# EAGLE design esp_vectorgame_v1.0 (EAGLE 9.6.2)
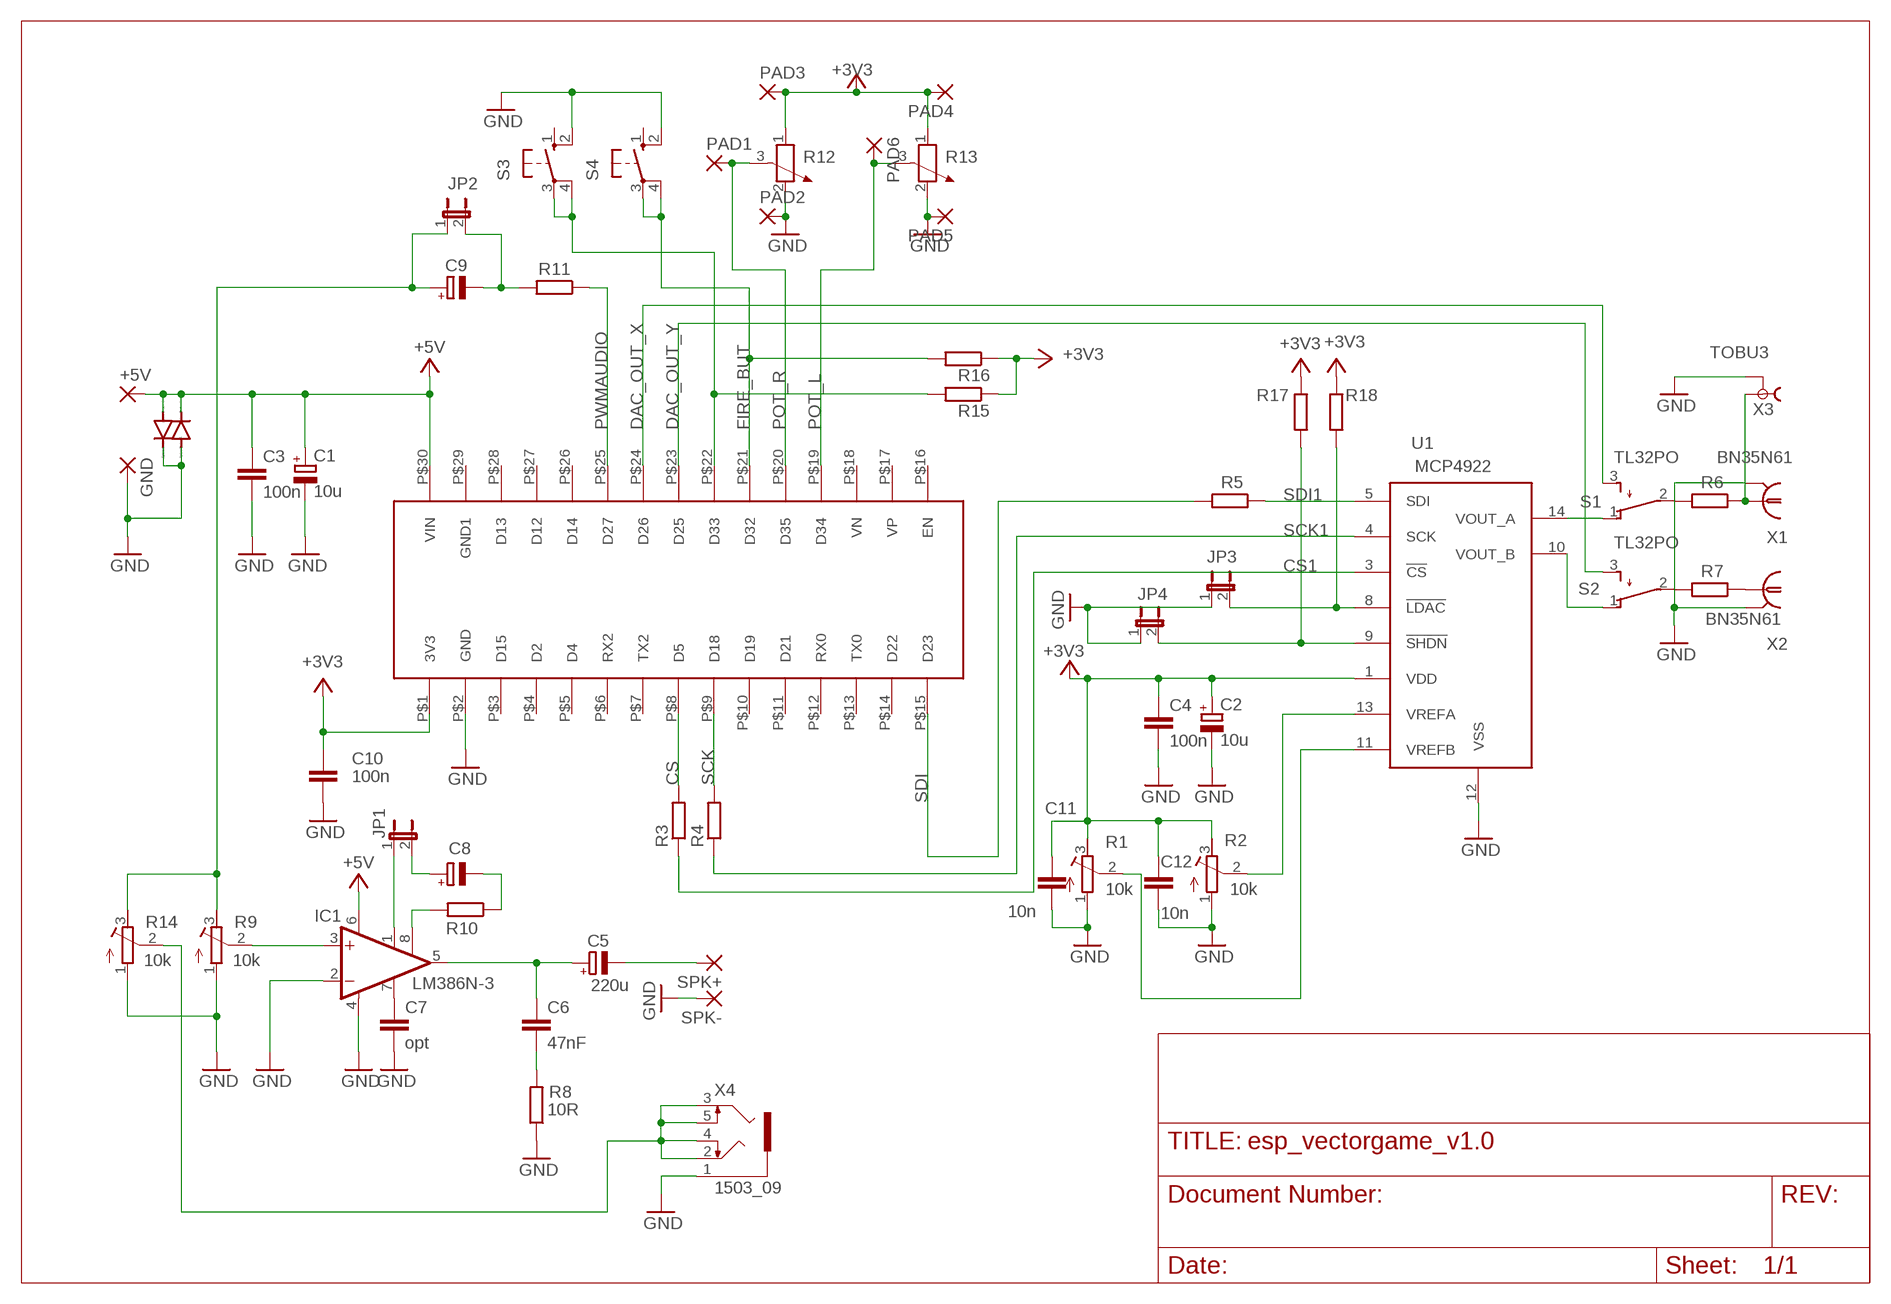
[diagram p0: schematic, sheet 1]

## Parts
+5V  3,81/1,4  [3,81/1,4]
C1  10u  CPOL-EUE2,5-6E  [E2,5-6E]
C2  10u  CPOL-EUE2,5-6E  [E2,5-6E]
C3  100n  C-EUC0805  [C0805]
C4  100n  C-EUC0805  [C0805]
C5  220u  CPOL-EUE2,5-6E  [E2,5-6E]
C6  47nF  C-EUC0805  [C0805]
C7  opt  C-EUC0805  [C0805]
C8  CPOL-EUE2,5-6E  [E2,5-6E]
C9  CPOL-EUE2,5-6E  [E2,5-6E]
C10  100n  C-EUC0805  [C0805]
C11  10n  C-EUC0805  [C0805]
C12  10n  C-EUC0805  [C0805]
GND  3,81/1,4  [3,81/1,4]
IC1  LM386N-3  [DIL08]
JP1  JP1E  [JP1]
JP2  JP1E  [JP1]
JP3  JP1E  [JP1]
JP4  JP1E  [JP1]
PAD1  3,81/1,4  [3,81/1,4]
PAD2  3,81/1,4  [3,81/1,4]
PAD3  3,81/1,4  [3,81/1,4]
PAD4  3,81/1,4  [3,81/1,4]
PAD5  3,81/1,4  [3,81/1,4]
PAD6  3,81/1,4  [3,81/1,4]
R1  10k  R-TRIMM64W  [RTRIM64W]
R2  10k  R-TRIMM64W  [RTRIM64W]
R3  R-EU_R0805  [R0805]
R4  R-EU_R0805  [R0805]
R5  R-EU_R0805  [R0805]
R6  R-EU_R0805  [R0805]
R7  R-EU_R0805  [R0805]
R8  10R  R-EU_R0805  [R0805]
R9  10k  R-TRIMM64W  [RTRIM64W]
R10  R-EU_R0805  [R0805]
R11  R-EU_R0805  [R0805]
R12  POTENTIOMETER_PT-10  [PT-10]
R13  POTENTIOMETER_PT-10  [PT-10]
R14  10k  R-TRIMM64W  [RTRIM64W]
R15  R-EU_R0805  [R0805]
R16  R-EU_R0805  [R0805]
R17  R-EU_R0805  [R0805]
R18  R-EU_R0805  [R0805]
S1  TL32PO  [TL3XPO]
S2  TL32PO  [TL3XPO]
S3  10-XX  [B3F-10XX]
S4  10-XX  [B3F-10XX]
SPK+  3,81/1,4  [3,81/1,4]
SPK-  3,81/1,4  [3,81/1,4]
TVS1  1N4148DO35-7  [DO35-7]
TVS2  1N4148DO35-7  [DO35-7]
U1  MCP4922  [SO-14]
U$2  ESP_WROOM32  [ESP_NODEMCU]
X1  BN35N61  [B35N61]
X2  BN35N61  [B35N61]
X3  TOBU3  [TOBU3]
X4  1503_09  [1503_09]

## Nets
+3V3: C2.+ C4.1 C10.1 C11.1 C12.1 PAD3.1(P) PAD4.1(P) R1.3(E) R2.3(E) R12.1 R13.1 R15.1 R16.1 R17.1 R18.1 U1.1(VDD) U$2.P$1(3V3)
+5V: +5V.1(P) C1.+ C3.1 IC1.6(VS) TVS1.C TVS2.A U$2.P$30(VIN)
CS: R3.2 U$2.P$8(D5)
CS1: R3.1 U1.3(!CS)
DAC_OUT_X: S1.3(S) U$2.P$24(D26)
DAC_OUT_Y: S2.3(S) U$2.P$23(D25)
FIRE_BUT: R16.2 S4.3(P) S4.4(P1) U$2.P$21(D32)
GND: C1.- C2.- C3.2 C4.2 C7.2 C10.2 C11.2 C12.2 GND.1(P) IC1.2(-IN) IC1.4(GND) JP3.1 JP4.1 PAD2.1(P) PAD5.1(P) R1.1(A) R2.1(A) R8.1 R9.1(A) R12.2 R13.2 R14.1(A) S3.2(S1) S4.2(S1) SPK-.1(P) TVS1.A TVS2.C U1.12(VSS) U$2.P$2(GND) X1.2 X1.3 X1.4 X1.5 X2.2 X2.3 X2.4 X2.5 X3.2 X3.2@1 X3.2@2 X4.1
N$1: JP3.2 R18.2 U1.8(!LDAC)
N$2: R7.1 X2.1
N$3: R7.2 S2.2(P)
N$4: S1.1(O) U1.14(VOUT_A)
N$6: R1.2(S) U1.11(VREFB)
N$7: R2.2(S) U1.13(VREFA)
N$8: S2.1(O) U1.10(VOUT_B)
N$9: R6.1 X1.1 X3.1
N$10: R6.2 S1.2(P)
N$11: C6.2 R8.2
N$12: IC1.1(GAIN) JP1.1
N$13: C5.+ C6.1 IC1.5(OUT)
N$14: C7.1 IC1.7(BYPASS)
N$15: IC1.3(+IN) R9.2(S)
N$16: C8.+ JP1.2
N$17: IC1.8(GAIN) R10.2
N$18: C8.- R10.1
N$19: C9.- JP2.2 R11.2
N$21: C9.+ JP2.1 R9.3(E) R14.3(E)
N$22: R14.2(S) X4.2 X4.3 X4.4 X4.5
N$23: C5.- SPK+.1(P)
N$24: R15.2 S3.3(P) S3.4(P1) U$2.P$22(D33)
N$25: JP4.2 R17.2 U1.9(!SHDN)
POT_L: PAD6.1(P) R13.3 U$2.P$19(D34)
POT_R: PAD1.1(P) R12.3 U$2.P$20(D35)
PWMAUDIO: R11.1 U$2.P$25(D27)
SCK: R4.2 U$2.P$9(D18)
SCK1: R4.1 U1.4(SCK)
SDI: R5.2 U$2.P$15(D23)
SDI1: R5.1 U1.5(SDI)
Unconnected: S3.1(S) S4.1(S) U$2.P$3(D15) U$2.P$4(D2) U$2.P$5(D4) U$2.P$6(RX2) U$2.P$7(TX2) U$2.P$10(D19) U$2.P$11(D21) U$2.P$12(RX0) U$2.P$13(TX0) U$2.P$14(D22) U$2.P$16(EN) U$2.P$17(VP) U$2.P$18(VN) U$2.P$26(D14) U$2.P$27(D12) U$2.P$28(D13) U$2.P$29(GND1)

## Library data of the parts
+5V GND PAD1-PAD6 SPK+ SPK- = wirepad:3,81/1,4: THROUGH-HOLE PAD
C1 C2 C5 C8 C9 = rcl:CPOL-EU: POLARIZED CAPACITOR, European symbol; SPICEPREFIX: C
C3 C4 C6 C7 C10-C12 = rcl:C-EU: CAPACITOR, European symbol; SPICEPREFIX: C
IC1 = linear_ingmar:LM386?-*: Low Voltage Audio Power Amplifier Source: http://cache.national.com/ds/LM/LM386.pdf
JP1-JP4 = jumper:JP1E: JUMPER
R1 R2 R9 R14 = rcl:R-TRIMM: Trimm resistor; SPICEMODEL: X; SPICEPREFIXL: POT
R3-R8 R10 R11 R15-R18 = rcl:R-EU_: RESISTOR, European symbol; SPICEPREFIX: R
R12 R13 = rcl:POTENTIOMETER_: Potentiometer; SPICEMODEL: POT; SPICEPREFIX: X
S1 S2 = switchneu:TL32PO: TINY SWITCH ON - MOM Source: http://www2.produktinfo.conrad.com/datenblaetter/700000-724999/705152-da-01-de-Subminiaturschalter_TL_36YO.pdf
S3 S4 = switch-omron:10-XX: OMRON SWITCH; MPN: B3F-1000; OC_FARNELL: 176432; OC_NEWARK: 36M3542
TVS1 TVS2 = diode:1N4148: DIODE high speed (Philips)
U1 = MCP4922:MCP4922: MCP4922 - 12bit DAC, SPI interface Datasheet: http://ww1.microchip.com/downloads/en/DeviceDoc/22250A.pdf
U$2 = meine:ESP_WROOM32
X1 X2 = con-coax:BN35N61: BNC CONNECTOR M/A COM www.macom.com distributor Farnell 149-452; OC_FARNELL: unknown; OC_NEWARK: unknown
X3 = con-hirschmann:TOBU3: Female Cinch CONNECTOR ( RCA Jack ); MF: FARNELL; MPN: TOBU 3; OC_FARNELL: 592791; OC_NEWARK: 06WX5914
X4 = con-lumberg:1503_09: Jack connectors according to JISC 6560, 3.5 mm Klinkeneinbaukupplung nach JISC 6560, 3,5 mm, 3-polig/ stereo, abgewinkelte Ausführung, mit 2 Öffnern und Lötaugen, für Leiterplatten Rückseitenmontage Source: http://www.lumberg.com/Produkte/PDFs/1503_09.pdf; OC_FARNELL: 1243244; OC_NEWARK: unknown

## Board
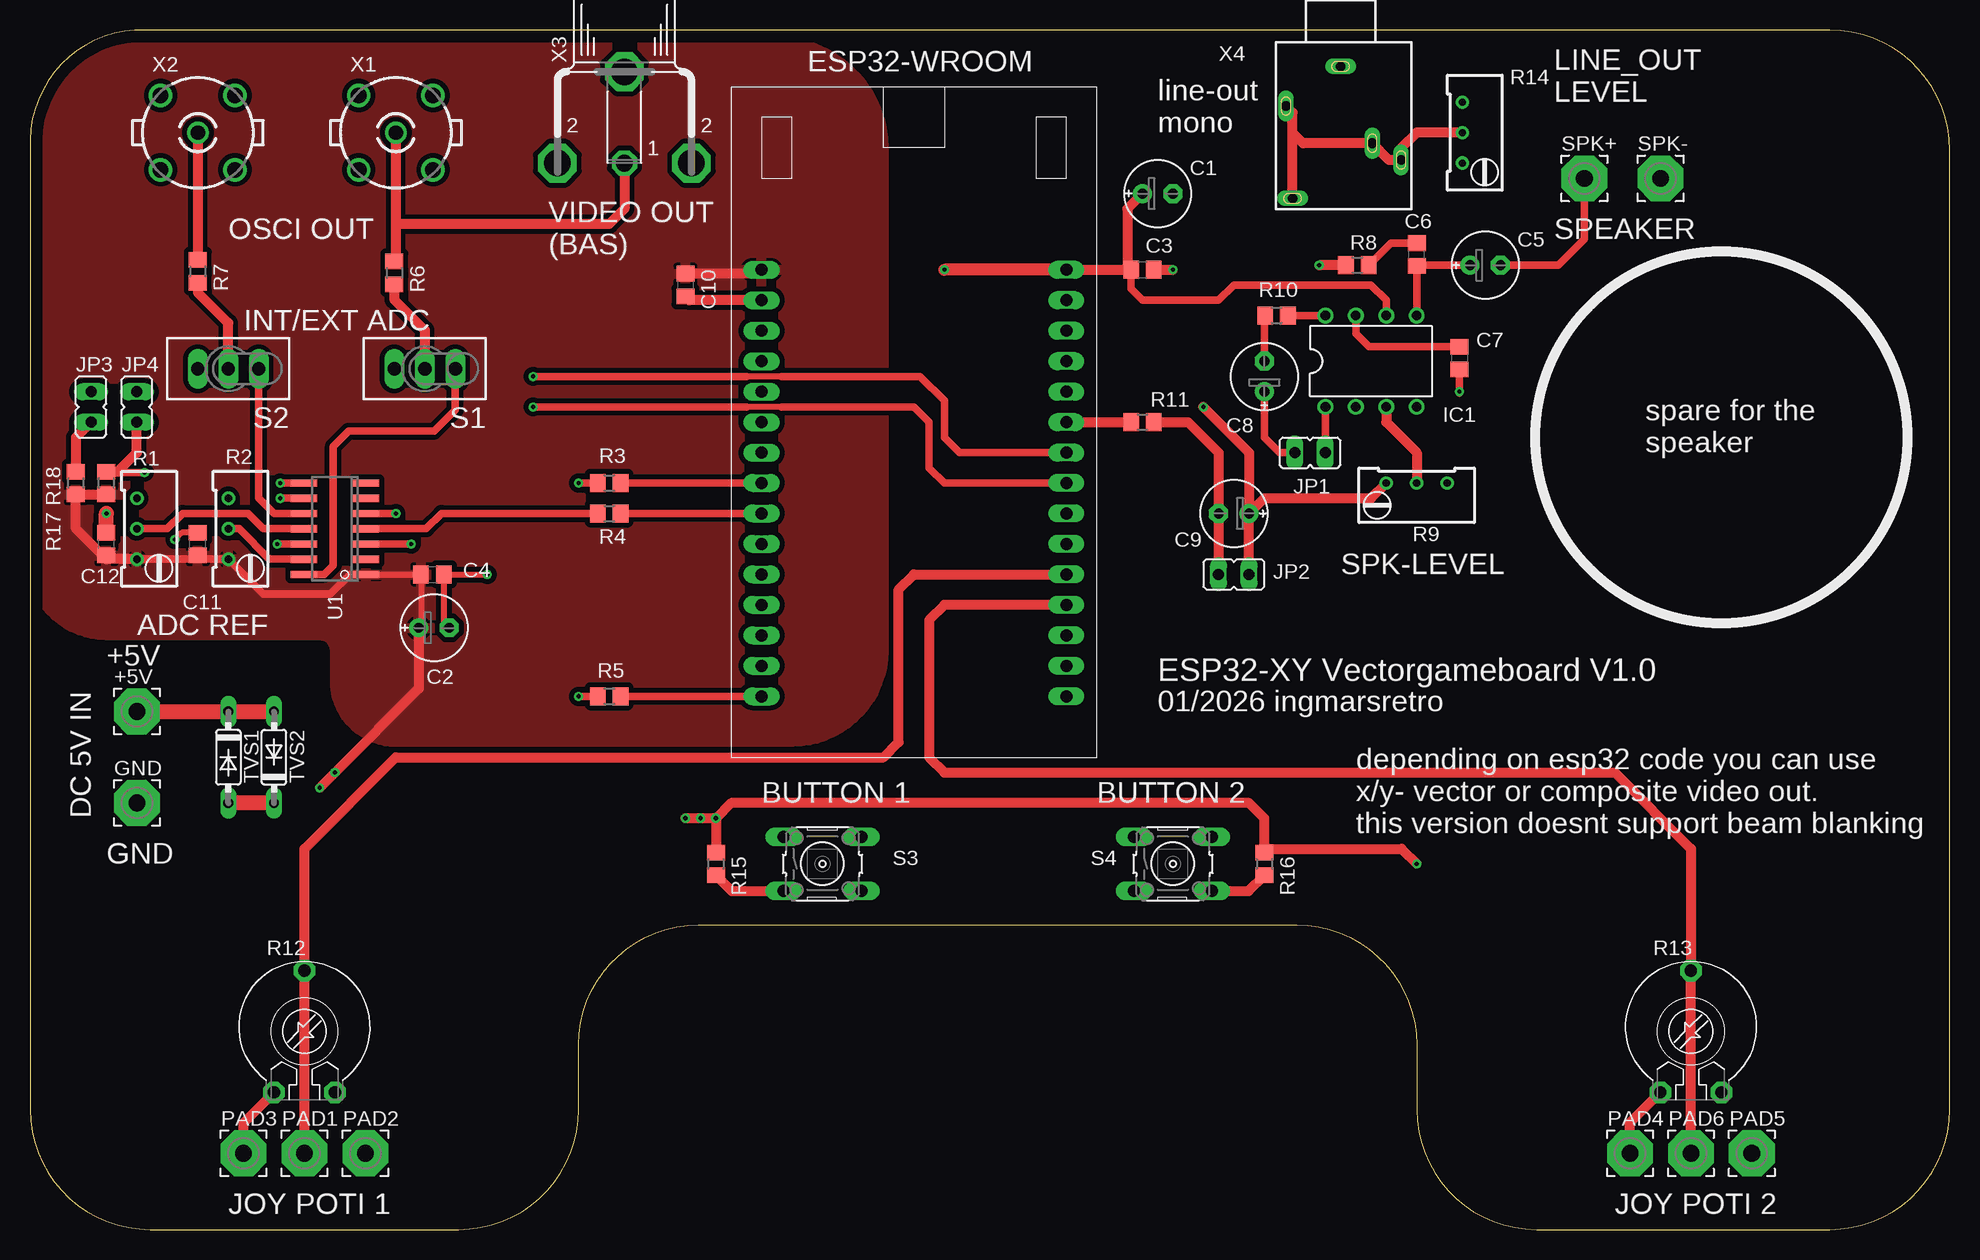
[diagram p1: board, top side]
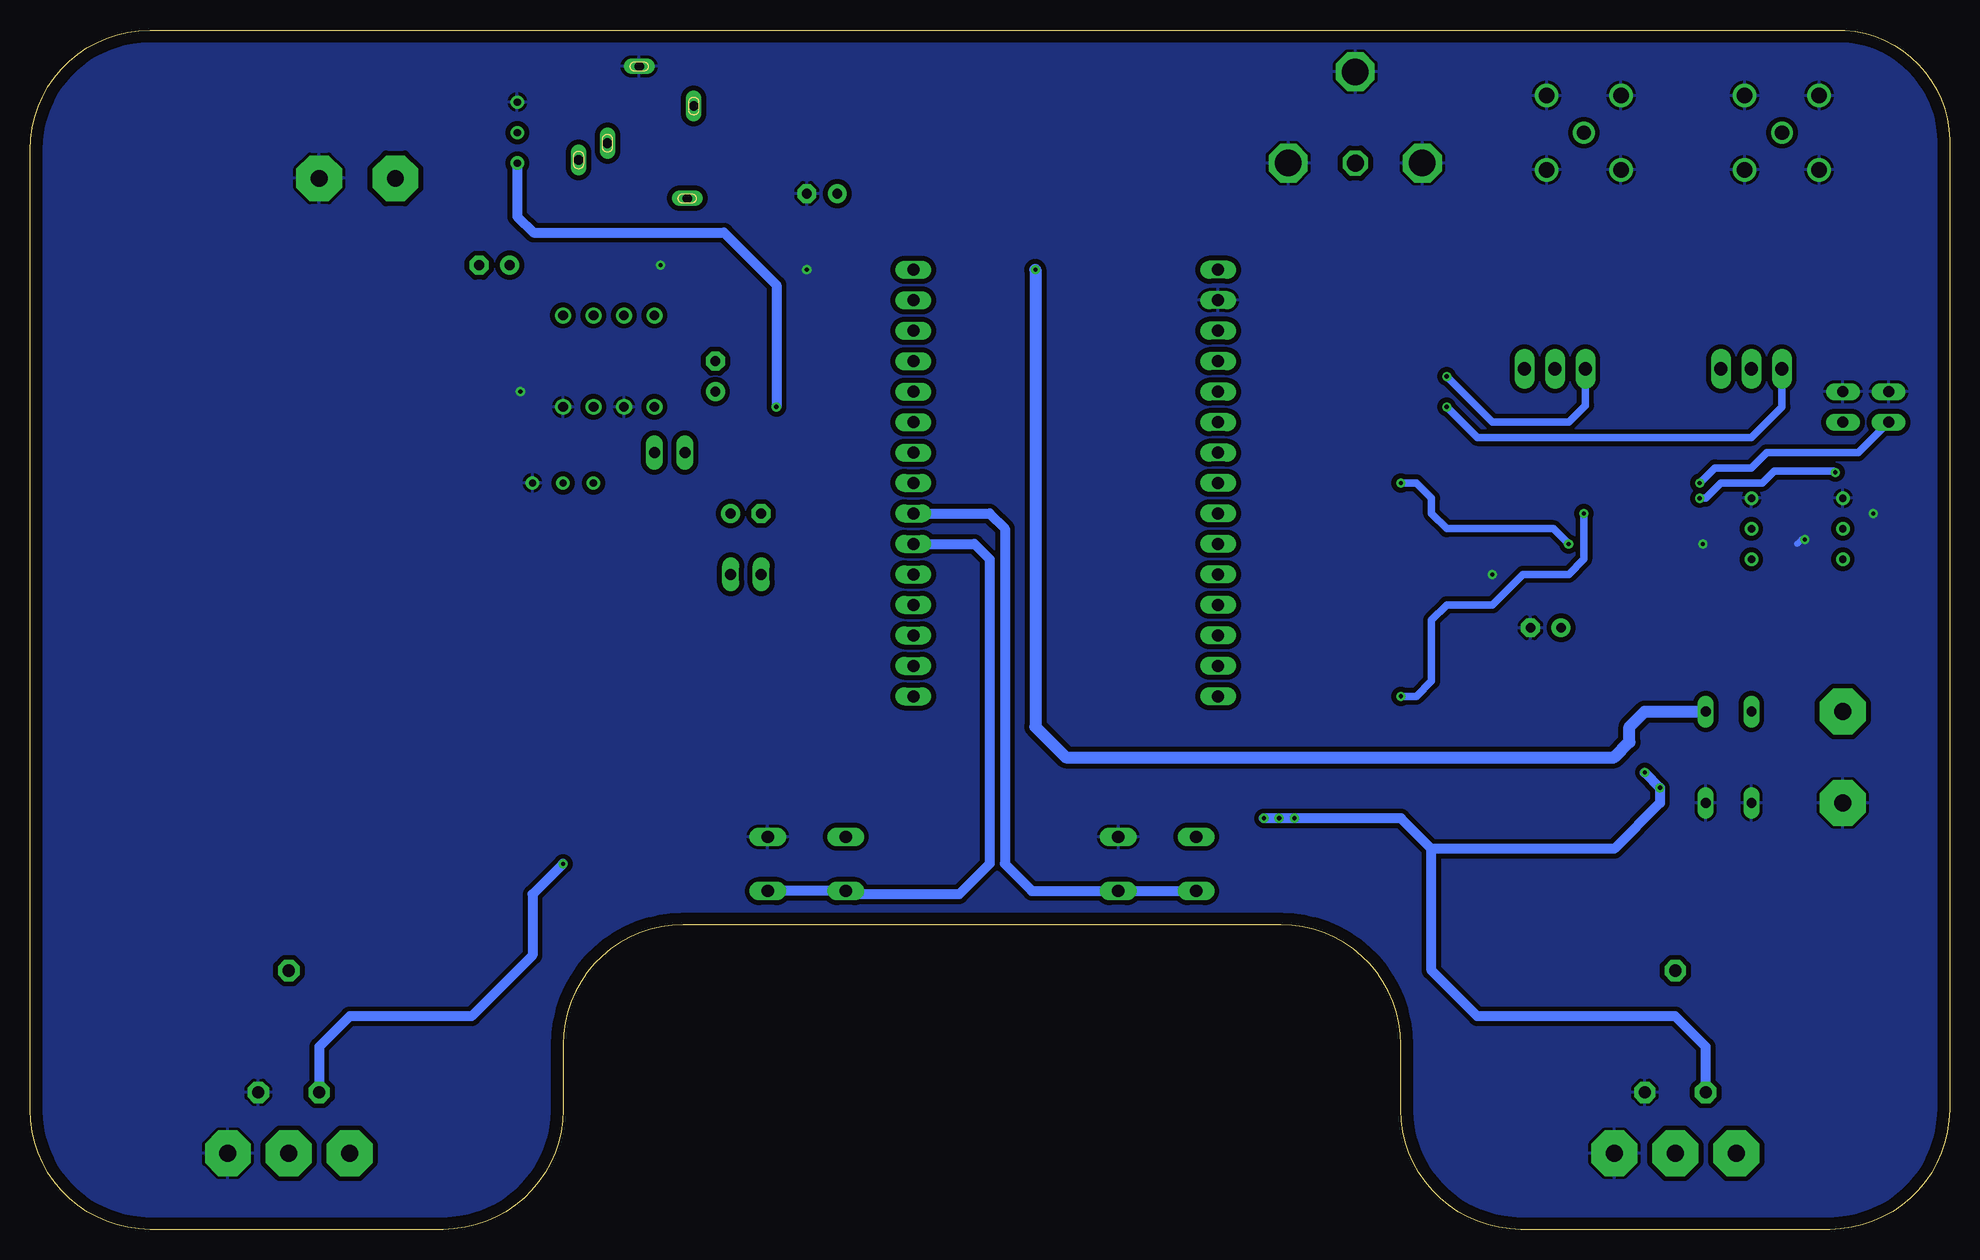
[diagram p2: board, bottom side, seen from below]

Size 160.02 x 100 mm. Coordinates in mm from the lower left corner, seen from the top.
Outline: 150.02,100 8.75,100 arc90 0.02,90 0.02,10 arc90 10.02,0 35.74,0 arc90 45.74,10 45.74,15.4 arc-90 55.74,25.4 105.59,25.4 arc-90 115.59,15.4 115.59,10 arc90 125.59,0 150.02,0 arc90 160.02,10 160.02,90 arc90 150.02,100
Copper layers (1*16): Top 0.035mm / dielectric 1.5mm / Bottom 0.035mm
Design rules "default": minimum track width 6mil, minimum drill 0.35mm, track to track 6mil, track to pad 6mil, pad to pad 6mil, via to via 6mil, smd to smd 6mil, copper to edge 40mil, drill to drill 6mil, minimum pad ring 10mil, minimum via ring 8mil, stop-mask expansion 4mil, vias tented up to drill 0mil, thermal gap 10mil

### Footprints (pad centres in the part's own frame; a part is rotated, then mirrored left to right if it is on the bottom)
3,81/1,4 = drill 1.397 pad 3.81 octagon: 1 0,0
E2,5-6E = drill 0.813 pad 1.575: + -1.27,0 | drill 0.813 pad 1.575 octagon: - 1.27,0
C0805 = smd 1.3 x 1.5: 1 -0.95,0; 2 0.95,0
DIL08 = drill 0.813 pad 1.27: 1 -3.81,-3.81; 2 -1.27,-3.81; 3 1.27,-3.81; 4 3.81,-3.81; 5 3.81,3.81; 6 1.27,3.81; 7 -1.27,3.81; 8 -3.81,3.81
JP1 = drill 0.914 long: 1 0,-1.27; 2 0,1.27
RTRIM64W = drill 0.61: 1 1.27,-2.54; 2 1.27,0; 3 1.27,2.54
R0805 = smd 1.3 x 1.5: 1 -0.95,0; 2 0.95,0
PT-10 = drill 1.016 pad 1.778 octagon: 1 -2.54,-5.08; 2 2.54,-5.08; 3 0,5.08
TL3XPO = drill 1.1 pad 1.422 long: 1 -2.54,0; 2 0,0; 3 2.54,0
B3F-10XX = drill 1.016 long: 1 -3.251,2.261; 2 3.251,2.261; 3 -3.251,-2.261; 4 3.251,-2.261
DO35-7 = drill 0.813 long: A 3.81,0; C -3.81,0
SO-14 = smd 0.6 x 2.2: 1 -3.81,-2.6; 2 -2.54,-2.6; 3 -1.27,-2.6; 4 0,-2.6; 5 1.27,-2.6; 6 2.54,-2.6; 7 3.81,-2.6; 8 3.81,2.6; 9 2.54,2.6; 10 1.27,2.6; 11 0,2.6; 12 -1.27,2.6; 13 -2.54,2.6; 14 -3.81,2.6
ESP_NODEMCU = drill 1 long: P$1 0,-12.7; P$2 2.54,-12.7; P$3 5.08,-12.7; P$4 7.62,-12.7; P$5 10.16,-12.7; P$6 12.7,-12.7; P$7 15.24,-12.7; P$8 17.78,-12.7; P$9 20.32,-12.7; P$10 22.86,-12.7; P$11 25.4,-12.7; P$12 27.94,-12.7; P$13 30.48,-12.7; P$14 33.02,-12.7; P$15 35.56,-12.7; P$16 35.56,12.7; P$17 33.02,12.7; P$18 30.48,12.7; P$19 27.94,12.7; P$20 25.4,12.7; P$21 22.86,12.7; P$22 20.32,12.7; P$23 17.78,12.7; P$24 15.24,12.7; P$25 12.7,12.7; P$26 10.16,12.7; P$27 7.62,12.7; P$28 5.08,12.7; P$29 2.54,12.7; P$30 0,12.7
B35N61 = drill 1.2: 1 0,0 | drill 1.3: 2 3.099,3.099; 3 -3.099,3.099; 4 -3.099,-3.099; 5 3.099,-3.099
TOBU3 = drill 1.397 octagon: 1 0,-2.54 | drill 2.21 octagon: 2 5.588,-2.54; 2@1 -5.588,-2.54; 2@2 0,5.08
1503_09 = drill 0.8 pad 1.2 long: 1 0,-2.1; 2 -4.55,-5.4; 3 5.05,-9.9; 4 -4,-13.1; 5 2.65,-8.5

### Placement (x,y rotation side)
+5V  8.91,43.18 0 top
C1  94,86.36 0 top
C2  33.67,50.16 0 top
C3  92.73,80.01 0 top
C4  33.55,54.61 0 top
C5  121.3,80.39 0 top
C6  115.59,81.28 90 top
C7  119.14,72.64 270 top
C8  102.89,71.12 90 top
C9  100.35,59.69 180 top
C10  54.63,78.74 270 top
C11  13.99,57.15 90 top
C12  6.37,57.15 90 top
GND  8.91,35.56 0 top
IC1  111.78,72.39 0 top
JP1  106.7,64.77 90 top
JP2  100.35,54.61 90 top
JP3  5.1,68.58 180 top
JP4  8.91,68.58 180 top
PAD1  22.88,6.35 0 top
PAD2  27.96,6.35 0 top
PAD3  17.8,6.35 0 top
PAD4  133.37,6.35 0 top
PAD5  143.53,6.35 0 top
PAD6  138.45,6.35 0 top
R1  10.18,58.42 180 top
R2  17.8,58.42 180 top
R3  48.28,62.23 0 top
R4  48.28,59.69 0 top
R5  48.28,44.45 0 top
R6  30.37,79.76 270 top
R7  13.99,79.88 270 top
R8  110.64,80.39 0 top
R9  115.59,60.96 90 top
R10  103.9,76.2 0 top
R11  92.73,67.31 0 top
R12  22.88,16.51 0 top
R13  138.45,16.51 0 top
R14  120.67,91.44 180 top
R15  57.17,30.48 270 top
R16  102.89,30.48 270 top
R17  6.37,62.23 90 top
R18  3.83,62.23 90 top
S1  32.91,71.75 180 top
S2  16.53,71.75 180 top
S3  66.06,30.48 0 top
S4  95.27,30.48 0 top
SPK+  129.56,87.63 0 top
SPK-  135.91,87.63 0 top
TVS1  16.53,39.37 270 top
TVS2  20.34,39.37 90 top
U1  25.42,58.42 90 top
U$2  73.68,80.01 270 top
X1  30.5,91.44 0 top
X2  13.99,91.44 0 top
X3  49.55,91.44 0 top
X4  109.24,99.06 0 top

### Tracks (layer width: path | path; a pad name or v marks a point on that pad's centre or on a via)
+3V3  (via drill 0.35)
  Top 0.508: U1.1 C4.1 32.6,50.16 C2.+ | C11.1 13.99,55.88 | C12.1 6.37,55.88
  Top 0.61: R1.3 13.99,55.88 R2.3 19.45,52.96 25.04,52.96 26.69,54.61 U1.1
  Top 0.813: R1.3 6.37,55.88 3.83,58.42 R18.1 R17.1 | v57.17,34.29 58.44,35.56 101.62,35.56 102.89,34.29 R16.1 103.21,31.75 114.32,31.75 v115.59,30.48 | v57.17,34.29 R15.1 | U$2.P$1 60.66,79.69 C10.1 | PAD4.1 133.37,8.89 R13.1 | PAD3.1 17.8,8.89 R12.1 | C2.+ 32.4,45.09 v25.42,38.1 v24.15,36.83 | v57.17,34.29 v54.63,34.29
  Bottom 0.813: R12.1 20.34,15.24 22.88,17.78 39.39,17.78 43.2,21.59 43.2,31.75 | R13.1 135.91,15.24 133.37,17.78 123.21,17.78 118.13,22.86 118.13,27.94 v115.59,30.48 | v55.9,34.29 45.74,34.29 43.2,31.75 | v55.9,34.29 v57.17,34.29 | v25.42,38.1 v24.15,36.83 24.15,35.56 27.96,31.75 43.2,31.75 | v54.63,34.29 v55.9,34.29
  pour Top (isolate 0.406): 8.91,99.06 62.25,99.06 arc-90 71.14,90.17 71.14,48.26 arc-90 63.52,40.64 30.5,40.64 arc-90 25.42,45.72 25.42,48.26 arc90 24.15,49.53 6.37,49.53 arc-90 0.02,55.88 0.02,91.44 arc-90 7.64,99.06
+5V  (via drill 0.35)
  Top 0.61: C3.1 91.78,78.42 92.73,77.47 99.08,77.47 100.35,78.74 111.78,78.74 113.05,77.47 IC1.6
  Top 0.813: C1.+ 91.46,85.09 91.46,80.33 C3.1 U$2.P$30
  Top 1.016: U$2.P$30 v76.22,80.01
  Top 1.27: +5V.1 TVS1.C TVS2.A
  Bottom 1.016: v76.22,80.01 76.22,41.91 73.68,39.37 27.96,39.37 26.69,40.64 26.69,41.91 25.42,43.18 TVS2.A
CS
  Top 0.61: U$2.P$8 R3.2
CS1  (via drill 0.35)
  Top 0.61: U1.3 v31.77,57.15 | v45.74,62.23 R3.1
  Bottom 0.61: v31.77,57.15 33.04,58.42 41.93,58.42 43.2,59.69 43.2,60.96 44.47,62.23 v45.74,62.23
DAC_OUT_X  (via drill 0.35)
  Top 0.508: 62.63,71.12 59.71,71.12
  Top 0.61: U$2.P$24 77.49,64.77 76.22,66.04 76.22,69.09 74.19,71.12 62.63,71.12 | 59.71,71.12 v41.93,71.12
  Bottom 0.61: v41.93,71.12 38.12,67.31 31.77,67.31 30.37,68.71 S1.3
DAC_OUT_Y  (via drill 0.35)
  Top 0.508: 62.63,68.58 59.71,68.58
  Top 0.61: U$2.P$23 76.22,62.23 74.95,63.5 74.95,67.31 73.68,68.58 62.63,68.58 | 59.71,68.58 v41.93,68.58
  Bottom 0.61: v41.93,68.58 39.39,66.04 16.53,66.04 13.99,68.58 S2.3
FIRE_BUT
  Top 0.813: S4.4 101.58,28.22 R16.2
  Bottom 0.813: U$2.P$21 81.3,57.15 80.03,55.88 80.03,30.48 82.57,27.94 92.73,27.94 92.45,28.22 S4.3 S4.4 | S4.4 98.8,28.22 99.08,27.94 98.8,27.94 S4.4
GND  (via drill 0.35)
  Top 0.508: C2.- 34.5,50.16 C4.2 v38.12,54.61 | C11.2 12.65,58.1 v12.08,57.53
  Top 0.61: U1.12 v20.59,57.15 | C7.2 v119.14,69.85 119.14,69.72
  Top 0.813: R8.1 v107.46,80.39 | C3.2 v95.27,80.01 | U$2.P$2 54.95,77.47 C10.2
  Top 1.27: TVS2.C TVS1.A | C12.2 v6.37,59.69
  Bottom 0.508: v12.08,57.53 12.34,57.53 12.72,57.15
  pour Bottom (isolate 0.406): 0.02,10 0.02,90.33 arc-90 10.02,100.33 150.04,100.33 arc-90 160.04,90.33 160.04,10 arc-90 150.04,0 125.59,0 arc-90 115.59,10 115.59,15.4 arc90 105.59,25.4 55.74,25.4 arc90 45.74,15.4 45.74,10 arc-90 35.74,0 10.02,0 arc-90
N$1  (via drill 0.35)
  Top 0.61: U1.8 v20.85,62.23
  Top 0.813: JP3.2 3.83,66.04 R18.2
  Bottom 0.61: v20.85,62.23 19.58,63.5 16.53,63.5 15.26,64.77 7.64,64.77 JP3.2
N$2
  Top 0.813: X2.1 R7.1
N$3
  Top 0.813: R7.2 13.99,78.11 16.53,75.56 S2.2
N$4
  Top 0.61: U1.14 24.53,54.61 25.29,55.37 25.29,65.28 26.56,66.55 33.67,66.55 35.45,68.33 S1.1
N$6
  Top 0.61: R1.2 11.45,58.42 12.72,59.69 18.18,59.69 19.45,58.42 U1.11
N$7
  Top 0.61: R2.2 17.42,58.42 19.96,55.88 U1.13
N$8
  Top 0.61: U1.10 20.34,59.69 19.07,60.96 S2.1
N$9
  Top 0.813: X1.1 30.5,83.82 | 30.5,83.82 30.5,80.83 R6.1 | X3.1 49.55,85.09 48.28,83.82 30.5,83.82
N$10
  Top 0.813: R6.2 30.37,77.54 32.91,75 S1.2
N$11
  Top 0.61: C6.2 113.42,82.23 R8.2
N$12
  Top 0.61: IC1.1 JP1.1
N$13
  Top 0.61: IC1.5 115.59,80.01 | 115.59,80.01 C6.1 | C5.+ 115.97,80.39 115.59,80.01
N$14
  Top 0.61: IC1.7 110.51,74.68 111.59,73.59 C7.1
N$15
  Top 0.813: IC1.3 113.05,67.31 115.59,64.77 R9.2
N$16
  Top 0.61: JP1.2 104.16,64.77 102.89,66.04 C8.+
N$17
  Top 0.61: R10.2 IC1.8
N$18
  Top 0.61: C8.- 102.89,76.13 R10.1
N$19
  Top 0.813: R11.2 96.54,67.31 99.08,64.77 C9.- JP2.2
N$21  (via drill 0.35)
  Top 0.813: JP2.1 C9.+ | C9.+ 102.89,60.96 111.78,60.96 R9.3 | v97.81,68.58 101.62,64.77 C9.+
  Bottom 0.813: R14.3 119.4,84.45 118.05,83.11 102.17,83.11 97.81,78.74 v97.81,68.58
N$22
  Top 0.813: R14.2 115.59,91.44 114.29,90.14 X4.3 113.29,89.16 X4.5 106.12,90.56 105.24,91.44 | X4.4 105.24,91.44 | 105.24,91.44 105.24,93.11 X4.2
N$23
  Top 0.61: C5.- 127.4,80.39 129.56,82.55 SPK+.1
N$24
  Top 0.813: R15.2 58.48,28.22 S3.3
  Bottom 0.813: U$2.P$22 80.03,59.69 78.76,58.42 78.76,30.48 76.5,28.22 S3.4 S3.3
N$25  (via drill 0.35)
  Top 0.61: U1.9 v20.85,60.96 | v9.54,63.12 6.43,63.12 R17.2
  Top 0.813: R17.2 7.32,63.18 8.91,64.77 JP4.2
  Bottom 0.61: v20.85,60.96 20.34,60.96 19.07,62.23 15.64,62.23 14.62,63.25 9.67,63.25 v9.54,63.12
POT_L
  Top 0.813: PAD6.1 R13.3 138.45,31.75 132.1,38.1 76.22,38.1 74.95,39.37 74.95,50.8 76.22,52.07 U$2.P$19
POT_R
  Top 0.813: PAD1.1 R12.3 22.88,31.75 30.5,39.37 71.14,39.37 72.41,40.64 72.41,53.34 73.68,54.61 U$2.P$20
PWMAUDIO
  Top 0.813: U$2.P$25 R11.1
SCK
  Top 0.61: U$2.P$9 R4.2
SCK1
  Top 0.61: R4.1 34.31,59.69 33.04,58.42 U1.4
SDI
  Top 0.61: U$2.P$15 R5.2
SDI1  (via drill 0.35)
  Top 0.61: U1.5 v30.5,59.69 | v45.74,44.45 R5.1
  Bottom 0.61: v30.5,59.69 30.5,55.88 31.77,54.61 35.58,54.61 38.12,52.07 41.93,52.07 43.2,50.8 43.2,45.72 44.47,44.45 v45.74,44.45

### Text on the board
tNames: ESP32-WROOM | LINE_OUT / LEVEL | line-out / mono | OSCI OUT | SPEAKER | VIDEO OUT / (BAS) | INT/EXT ADC | spare for the / speaker | SPK-LEVEL | ADC REF | +5V | ESP32-XY Vectorgameboard V1.0 | 01/2026 ingmarsretro | BUTTON 1 | BUTTON 2 | DC 5V IN | depending on esp32 code you can use / x/y- vector or composite video out. / this version doesnt support beam blanking | GND | JOY POTI 1 | JOY POTI 2